# Altium schematic sheet Phy Daughter Board Header.SchDoc
size A; CompanyName: Microchip Technology Inc.; Organization: Microchip Technology; Address1: 2355 West Chandler Blvd.; Address2: Chandler, AZ  85224; Address4: USA; DocumentNumber: 2; SheetNumber: 2; SheetTotal: 5; SheetTitle: Phy Daughter Board Header; Time: Time
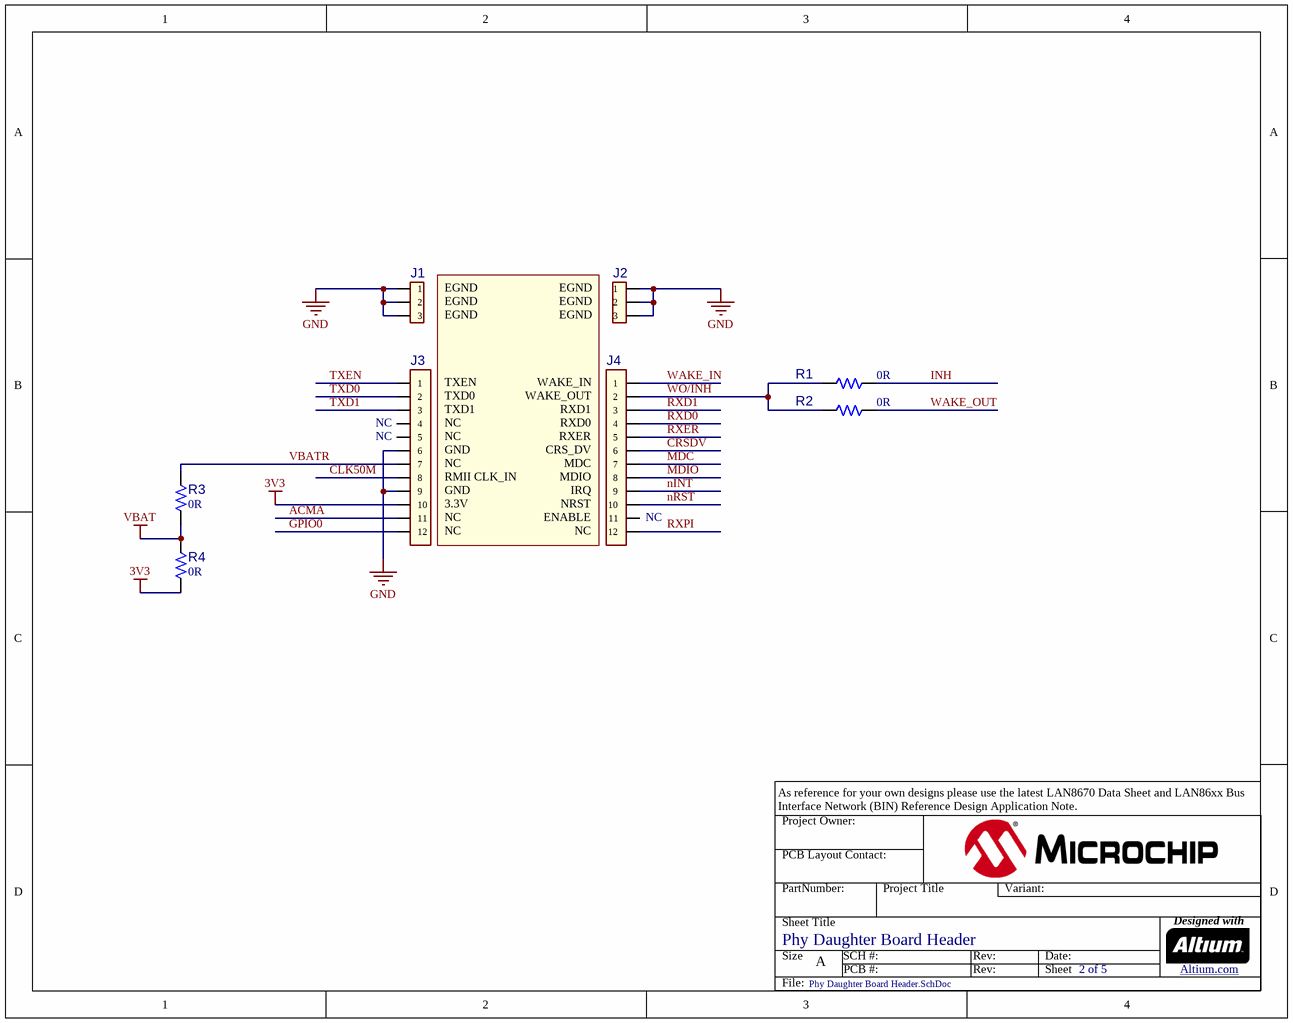
[diagram p0: Phy Daughter Board Header.SchDoc]

## Parts
J1  Header 1x3  [HDR_M_1.27_1x3_TMS_103-02_L_S]  (value not drawn)
J2  Header 1x3  [HDR_M_1.27_1x3_TMS_103-02_L_S]  (value not drawn)
J3  Header 1x12  [HDR_M_1.27_1x12]  (value not drawn)
J4  Header 1x12  [HDR_M_1.27_1x12]  (value not drawn)
R1  value 0R  [RES_C_0402]  (hidden comment: Resistor)
R2  value 0R  [RES_C_0402]  (hidden comment: Resistor)
R3  value 0R  [RES_C_0603]  (hidden comment: Resistor)
R4  value 0R  [RES_C_0603]  (hidden comment: Resistor)

## Nets
3V3: J3.10 R4.1
GND: J1.1 J1.2 J1.3 J2.1 J2.2 J2.3 J3.6 J3.9
VBAT: R3.1 R4.2
ACMA: J3.11
CLK50M: J3.8
CRSDV: J4.6
GPIO0: J3.12
INH: R1.2
MDC: J4.7
MDIO: J4.8
nINT: J4.9
nRST: J4.10
RXD0: J4.4
RXD1: J4.3
RXER: J4.5
RXPI: J4.12
TXD0: J3.2
TXD1: J3.3
TXEN: J3.1
VBATR: J3.7 R3.2
WAKE_IN: J4.1
WAKE_OUT: R2.2
WO/INH: J4.2 R1.1 R2.1

Not connected (* = marked no-connect by the designer): J3 4 5; J4 11

## Notes on the sheet
- (near J1) EGND
- (near J2) EGND
- (near J3) NC
- (near J3) TXEN
- (near J3) TXD0
- (near J3) TXD1
- (near J4) WAKE_IN
- (near J4) WAKE_OUT
- (near J4) RXD1
- (near J4) RXD0
- (near J3) GND
- (near J3) RMII CLK_IN
- (near J3) 3.3V
- (near J4) RXER
- (near J4) CRS_DV
- (near J4) MDC
- (near J4) MDIO
- (near J4) IRQ
- (near J4) NRST
- (near J4) ENABLE
- (near J4) NC
- As reference for your own designs please use the latest LAN8670 Data Sheet and LAN86xx Bus Interface Network (BIN) Reference Design Application Note.
- Project Owner:
- PCB Layout Contact:
- PartNumber:
- Project Title
- Variant:
- Sheet Title
- Size
- A
- SCH #:
- PCB #:
- Rev:
- Date:
- Sheet
- Designed with
- Altium.com <http://go.altium.com/MicrochipLandingPage_Evaluation.html>
- File:

## Library data of the parts
J1 J2 = CON1213: Manufacturer 1: Samtec; Manufacturer Part Number 1: TMS-103-02-L-S; Description_: CON HDR-1.27 Male 1X3 TH VERT; Owner: Leah Whitaker; Populated: YES; Dev Tools Status: Production; MCHP-ID: CON1213; Revision: 0; Status: MCL Design; Type: Header 1.27mm; Category: Connector; Supplier 1: Samtec; Supplier Part Number 1: TMS-103-02-L-S; Quantity Override: 1; Symbol: Header 1X3; ComponentLink1Description: SVN Datasheet; ComponentLink2Description: Local Datasheet; ComponentLink3URL: C:\ALTIUM_WORK\00001_MCHP-CDB\Library\LibraryRefs\Header 1X3.SchLib; ComponentLink3Description: Open Symbol; ComponentLink4URL: C:\ALTIUM_WORK\00001_MCHP-CDB\Library\Footprints\HDR_M_1.27_1x3_TMS_103-02_L_S.PcbLib; ComponentLink4Description: Open Footprint; ComponentLink5Description: Open Footprint 2; ComponentLink6Description: Open Footprint 3; ComponentLink7Description: Open Footprint 4
J3 J4 = CON1212: Manufacturer 1: Samtec; Manufacturer Part Number 1: TMS-112-02-L-S; Description_: CON HDR-1.27 Male 1X12 TH VERT; Owner: Leah Whitaker; Populated: YES; Dev Tools Status: Production; MCHP-ID: CON1212; Revision: 0; Status: MCL Design; Type: Header 1.27mm; Category: Connector; Supplier 1: Samtec; Supplier Part Number 1: TMS-112-02-L-S; Quantity Override: 1; Symbol: Header 1X12; ComponentLink1Description: SVN Datasheet; ComponentLink2Description: Local Datasheet; ComponentLink3URL: C:\ALTIUM_WORK\00001_MCHP-CDB\Library\LibraryRefs\Header 1X12.SchLib; ComponentLink3Description: Open Symbol; ComponentLink4URL: C:\ALTIUM_WORK\00001_MCHP-CDB\Library\Footprints\HDR_M_1.27_1x12.PcbLib; ComponentLink4Description: Open Footprint; ComponentLink5Description: Open Footprint 2; ComponentLink6Description: Open Footprint 3; ComponentLink7Description: Open Footprint 4
R1 R2 = RSMT1246: Manufacturer 1: Panasonic Electronic Components; Manufacturer Part Number 1: ERJ-2GE0R00X; Description_: RES TKF 0R 1/10W SMD 0402; Tolerance: 50mOhm; Power: 1/10W; Owner: Dragos Danaila; Populated: YES; Dev Tools Status: Production; Voltage: 50V; Current: 1A; MCHP-ID: RSMT1246; Revision: 1; Status: MCL Design; Package: 0402; Operating Temperature: -55C to +155C; Category: Resistor; Type: RES SMD; Composition: TKF; Supplier 1: Digi-Key; Supplier Part Number 1: P0.0JCT-ND; Quantity Override: 1; Symbol: Resistor; ComponentLink1URL: https://chn-vm-apps.microchip.com/mchprepo/parts/Datasheets/DMA0000COL9.pdf; ComponentLink1Description: SVN Datasheet; ComponentLink2URL: C:\ALTIUM_WORK\00001_MCHP-CDB\Datasheets\DMA0000COL9.pdf; ComponentLink2Description: Local Datasheet; ComponentLink3URL: C:\ALTIUM_WORK\00001_MCHP-CDB\Library\LibraryRefs\Resistor.SchLib; ComponentLink3Description: Open Symbol; ComponentLink4URL: C:\ALTIUM_WORK\00001_MCHP-CDB\Library\Footprints\RES_C_0402.PcbLib; ComponentLink4Description: Open Footprint; ComponentLink5Description: Open Footprint 2; ComponentLink6Description: Open Footprint 3; ComponentLink7Description: Open Footprint 4
R3 R4 = RES2360: Manufacturer 1: Panasonic Electronic Components; Manufacturer Part Number 1: ERJ-3GEY0R00V; Description_: RES TKF 0R 1/10W SMD 0603 AEC-Q200; Power: 1/10W; Owner: Steve Dziaba; Populated: YES; Dev Tools Status: Production; Circuit Type: Isolated; MCHP-ID: RES2360; Revision: 1; Status: MCL Design; Package: 0603; Category: Resistor; Type: RES SMD; Composition: TKF; Supplier 1: Digi-Key; Supplier Part Number 1: P0.0GCT-ND; Quantity Override: 1; Symbol: Resistor; ComponentLink1URL: https://chn-vm-apps.microchip.com/mchprepo/parts/Datasheets/ERJ-3GEY0R00V.pdf; ComponentLink1Description: SVN Datasheet; ComponentLink2URL: C:\ALTIUM_WORK\00001_MCHP-CDB\Datasheets\ERJ-3GEY0R00V.pdf; ComponentLink2Description: Local Datasheet; ComponentLink3URL: C:\ALTIUM_WORK\00001_MCHP-CDB\Library\LibraryRefs\Resistor.SchLib; ComponentLink3Description: Open Symbol; ComponentLink4URL: C:\ALTIUM_WORK\00001_MCHP-CDB\Library\Footprints\RES_C_0603.PcbLib; ComponentLink4Description: Open Footprint; ComponentLink5Description: Open Footprint 2; ComponentLink6Description: Open Footprint 3; ComponentLink7Description: Open Footprint 4; Manufacturer 2: Vishay; Manufacturer Part Number 2: CRCW06030000Z0EB; Supplier 2: Digi-Key; Supplier Part Number 2: 541-2968-1-ND